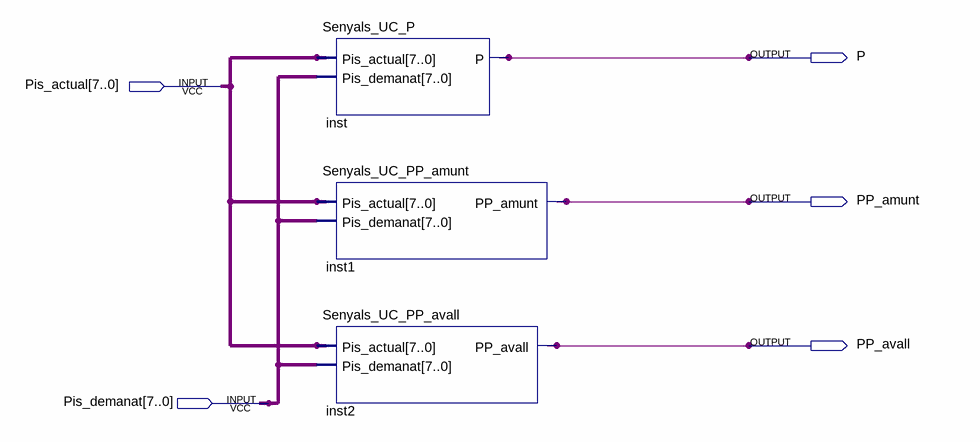
[diagram p0: schematic sheet]
// Quartus schematic Senyals_UC.bdf as structural Verilog: 3 symbols, 5 pins
module Senyals_UC (
  input  [7:0] Pis_actual,
  input  [7:0] Pis_demanat,
  output P,
  output PP_amunt,
  output PP_avall
);

  Senyals_UC_P inst (.Pis_actual(Pis_actual), .Pis_demanat(Pis_demanat), .P(P));
  Senyals_UC_PP_amunt inst1 (.Pis_actual(Pis_actual), .Pis_demanat(Pis_demanat), .PP_amunt(PP_amunt));
  Senyals_UC_PP_avall inst2 (.Pis_actual(Pis_actual), .Pis_demanat(Pis_demanat), .PP_avall(PP_avall));
endmodule
